# EAGLE schematic 130805_AriloRX_0_0 (EAGLE 6.1)
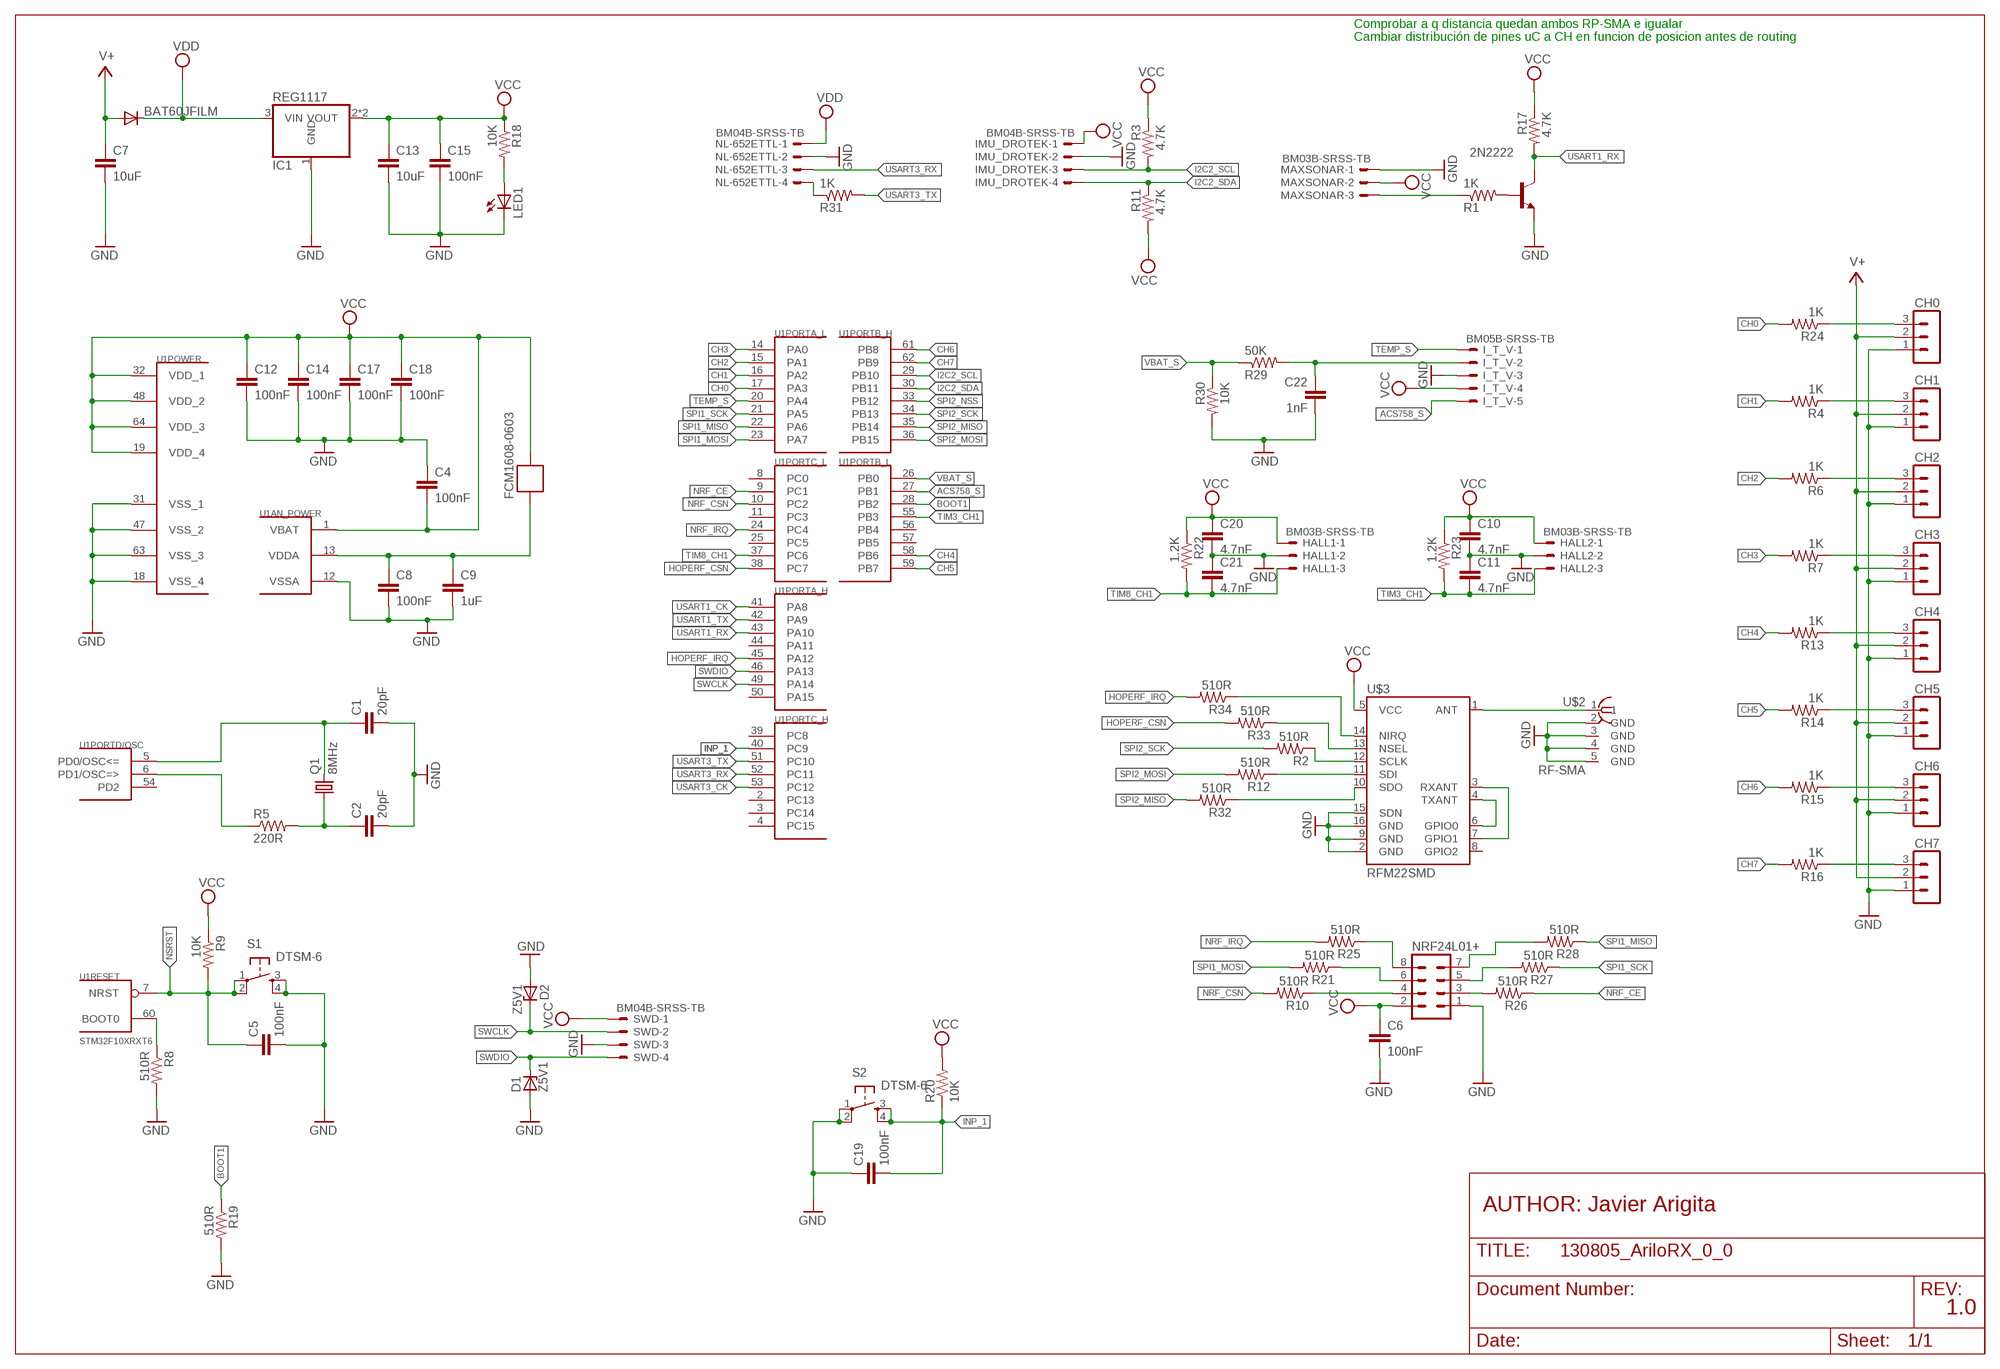
[diagram p0: schematic, sheet 1]

## Parts
2N2222  MMBT2222ALT1-NPN-SOT23-BEC  [SOT23-BEC]
BAT60JFILM  DIODE-SOD323-R  [SOD323-R]
C1  20pF  C-EUC0805  [C0805]
C2  20pF  C-EUC0805  [C0805]
C4  100nF  C-EUC0805  [C0805]
C5  100nF  C-EUC0805  [C0805]
C6  100nF  C-EUC0805  [C0805]
C7  10uF  C-EUC3216  [C3216]
C8  100nF  C-EUC0805  [C0805]
C9  1uF  C-EUC3216  [C3216]
C10  4.7nF  C-EUC0805  [C0805]
C11  4.7nF  C-EUC0805  [C0805]
C12  100nF  C-EUC0805  [C0805]
C13  10uF  C-EUC3216  [C3216]
C14  100nF  C-EUC0805  [C0805]
C15  100nF  C-EUC0805  [C0805]
C17  100nF  C-EUC0805  [C0805]
C18  100nF  C-EUC0805  [C0805]
C19  100nF  C-EUC0805  [C0805]
C20  4.7nF  C-EUC0805  [C0805]
C21  4.7nF  C-EUC0805  [C0805]
C22  1nF  C-EUC0805  [C0805]
CH0  MA03-1  [MA03-1]
CH1  MA03-1  [MA03-1]
CH2  MA03-1  [MA03-1]
CH3  MA03-1  [MA03-1]
CH4  MA03-1  [MA03-1]
CH5  MA03-1  [MA03-1]
CH6  MA03-1  [MA03-1]
CH7  MA03-1  [MA03-1]
D1  Z5V1  ZENER-DIODESOD80C  [SOD80C]
D2  Z5V1  ZENER-DIODESOD80C  [SOD80C]
FCM1608-0603  FERRITE-BEAD  [R0603]
HALL1  BM03B-SRSS-TB  [BM03B-SRSS-TB]
HALL2  BM03B-SRSS-TB  [BM03B-SRSS-TB]
I_T_V  BM05B-SRSS-TB  [BM05B-SRSS-TB]
IC1  REG1117  [SOT223]
IMU_DROTEK  BM04B-SRSS-TB  [BM04B-SRSS-TB]
LED1  LED0805  [CHIPLED_0805]
MAXSONAR  BM03B-SRSS-TB  [BM03B-SRSS-TB]
NL-652ETTL  BM04B-SRSS-TB  [BM04B-SRSS-TB]
NRF24L01+  MA04-2  [MA04-2]
Q1  8MHz  CRYSTALSM49  [SM49]
R1  1K  RESISTOR0805  [R0805]
R2  510R  RESISTOR0805  [R0805]
R3  4.7K  RESISTOR0805  [R0805]
R4  1K  RESISTOR0805  [R0805]
R5  220R  RESISTOR0805  [R0805]
R6  1K  RESISTOR0805  [R0805]
R7  1K  RESISTOR0805  [R0805]
R8  510R  RESISTOR0805  [R0805]
R9  10K  RESISTOR0805  [R0805]
R10  510R  RESISTOR0805  [R0805]
R11  4.7K  RESISTOR0805  [R0805]
R12  510R  RESISTOR0805  [R0805]
R13  1K  RESISTOR0805  [R0805]
R14  1K  RESISTOR0805  [R0805]
R15  1K  RESISTOR0805  [R0805]
R16  1K  RESISTOR0805  [R0805]
R17  4.7K  RESISTOR0805  [R0805]
R18  10K  RESISTOR0805  [R0805]
R19  510R  RESISTOR0805  [R0805]
R20  10K  RESISTOR0805  [R0805]
R21  510R  RESISTOR0805  [R0805]
R22  1.2K  RESISTOR0805  [R0805]
R23  1.2K  RESISTOR0805  [R0805]
R24  1K  RESISTOR0805  [R0805]
R25  510R  RESISTOR0805  [R0805]
R26  510R  RESISTOR0805  [R0805]
R27  510R  RESISTOR0805  [R0805]
R28  510R  RESISTOR0805  [R0805]
R29  50K  RESISTOR0805  [R0805]
R30  10K  RESISTOR0805  [R0805]
R31  1K  RESISTOR0805  [R0805]
R32  510R  RESISTOR0805  [R0805]
R33  510R  RESISTOR0805  [R0805]
R34  510R  RESISTOR0805  [R0805]
S1  DTSM-6  [DTSM-6]
S2  DTSM-6  [DTSM-6]
SWD  BM04B-SRSS-TB  [BM04B-SRSS-TB]
U1  STM32F10XRXT6  [TQFP64]
U$2  RF-SMA  [BU-SMA-H]
U$3  RFM22SMD  [RFM22-XXX-S2]

## Nets
ACS758_S: I_T_V.5 U1.27(PORTB_L:PB1)
BOOT1: R19.1 U1.28(PORTB_L:PB2)
CH0: R24.2 U1.17(PORTA_L:PA3)
CH1: R4.2 U1.16(PORTA_L:PA2)
CH2: R6.2 U1.15(PORTA_L:PA1)
CH3: R7.2 U1.14(PORTA_L:PA0)
CH4: R13.2 U1.58(PORTB_L:PB6)
CH5: R14.2 U1.59(PORTB_L:PB7)
CH6: R15.2 U1.61(PORTB_H:PB8)
CH7: R16.2 U1.62(PORTB_H:PB9)
GND: 2N2222.E C1.2 C2.2 C4.1 C5.2 C6.2 C7.2 C8.2 C9.2 C10.2 C11.1 C12.2 C13.2 C14.2 C15.2 C17.2 C18.2 C19.1 C20.2 C21.1 C22.2 CH0.1 CH1.1 CH2.1 CH3.1 CH4.1 CH5.1 CH6.1 CH7.1 D1.A D2.A HALL1.2 HALL2.2 I_T_V.3 IC1.1(GND) IMU_DROTEK.2 LED1.C MAXSONAR.1 NL-652ETTL.2 NRF24L01+.1 R8.2 R19.2 R30.2 S1.3 S1.4 S2.1 S2.2 SWD.3 U1.12(AN_POWER:VSSA) U1.18(POWER:VSS_4) U1.31(POWER:VSS_1) U1.47(POWER:VSS_2) U1.63(POWER:VSS_3) U$2.2(GND) U$2.3(GND) U$2.4(GND) U$2.5(GND) U$3.2(GND) U$3.9(GND) U$3.15(SDN) U$3.16(GND)
HOPERF_CSN: R33.2 U1.38(PORTC_L:PC7)
HOPERF_IRQ: R34.2 U1.45(PORTA_H:PA12)
I2C2_SCL: IMU_DROTEK.3 R3.2 U1.29(PORTB_H:PB10)
I2C2_SDA: IMU_DROTEK.4 R11.1 U1.30(PORTB_H:PB11)
INP_1: C19.2 R20.1 S2.3 S2.4 U1.40(PORTC_H:PC9)
N$1: C1.1 Q1.2 U1.5(PORTD/OSC:PD0/OSC<=)
N$2: R5.1 U1.6(PORTD/OSC:PD1/OSC=>)
N$3: C2.1 Q1.1 R5.2
N$4: R8.1 U1.60(RESET:BOOT0)
N$5: U$3.3(RXANT) U$3.7(GPIO1)
N$6: U$3.4(TXANT) U$3.6(GPIO0)
N$7: R2.1 U$3.12(SCLK)
N$8: R12.1 U$3.11(SDI)
N$9: CH0.3 R24.1
N$10: LED1.A R18.2
N$11: NL-652ETTL.4 R31.1
N$12: R32.1 U$3.10(SDO)
N$14: MAXSONAR.3 R1.1
N$15: C22.1 I_T_V.2 R29.2
N$16: 2N2222.B R1.2
N$17: C8.1 C9.1 FCM1608-0603.2 U1.13(AN_POWER:VDDA)
N$18: NRF24L01+.4 R10.1
N$19: NRF24L01+.3 R26.2
N$20: U$2.1 U$3.1(ANT)
N$21: CH2.3 R6.1
N$22: R34.1 U$3.14(NIRQ)
N$23: CH4.3 R13.1
N$24: R33.1 U$3.13(NSEL)
N$31: CH3.3 R7.1
N$32: CH6.3 R15.1
N$34: CH5.3 R14.1
N$35: CH7.3 R16.1
N$36: NRF24L01+.5 R27.2
N$38: NRF24L01+.6 R21.1
N$39: NRF24L01+.8 R25.1
N$42: NRF24L01+.7 R28.2
N$53: CH1.3 R4.1
NRF_CE: R26.1 U1.9(PORTC_L:PC1)
NRF_CSN: R10.2 U1.10(PORTC_L:PC2)
NRF_IRQ: R25.2 U1.24(PORTC_L:PC4)
NSRST: C5.1 R9.2 S1.1 S1.2 U1.7(RESET:NRST)
SPI1_MISO: R28.1 U1.22(PORTA_L:PA6)
SPI1_MOSI: R21.2 U1.23(PORTA_L:PA7)
SPI1_SCK: R27.1 U1.21(PORTA_L:PA5)
SPI2_MISO: R32.2 U1.35(PORTB_H:PB14)
SPI2_MOSI: R12.2 U1.36(PORTB_H:PB15)
SPI2_NSS: U1.33(PORTB_H:PB12)
SPI2_SCK: R2.2 U1.34(PORTB_H:PB13)
SWCLK: D2.C SWD.2 U1.49(PORTA_H:PA14)
SWDIO: D1.C SWD.4 U1.46(PORTA_H:PA13)
TEMP_S: I_T_V.1 U1.20(PORTA_L:PA4)
TIM3_CH1: C11.2 HALL2.3 R23.2 U1.55(PORTB_L:PB3)
TIM8_CH1: C21.2 HALL1.3 R22.2 U1.37(PORTC_L:PC6)
USART1_CK: U1.41(PORTA_H:PA8)
USART1_RX: 2N2222.C R17.2 U1.43(PORTA_H:PA10)
USART1_TX: U1.42(PORTA_H:PA9)
USART3_CK: U1.53(PORTC_H:PC12)
USART3_RX: NL-652ETTL.3 U1.52(PORTC_H:PC11)
USART3_TX: R31.2 U1.51(PORTC_H:PC10)
V+: BAT60JFILM.A C7.1 CH0.2 CH1.2 CH2.2 CH3.2 CH4.2 CH5.2 CH6.2 CH7.2
VBAT_S: R29.1 R30.1 U1.26(PORTB_L:PB0)
VCC: C4.2 C6.1 C10.1 C12.1 C13.1 C14.1 C15.1 C17.1 C18.1 C20.1 FCM1608-0603.1 HALL1.1 HALL2.1 I_T_V.4 IC1.2(VOUT) IC1.4(VOUT) IMU_DROTEK.1 MAXSONAR.2 NRF24L01+.2 R3.1 R9.1 R11.2 R17.1 R18.1 R20.2 R22.1 R23.1 SWD.1 U1.1(AN_POWER:VBAT) U1.19(POWER:VDD_4) U1.32(POWER:VDD_1) U1.48(POWER:VDD_2) U1.64(POWER:VDD_3) U$3.5(VCC)
VDD: BAT60JFILM.C IC1.3(VIN) NL-652ETTL.1
Unconnected: U1.2(PORTC_H:PC13) U1.3(PORTC_H:PC14) U1.4(PORTC_H:PC15) U1.8(PORTC_L:PC0) U1.11(PORTC_L:PC3) U1.25(PORTC_L:PC5) U1.39(PORTC_H:PC8) U1.44(PORTA_H:PA11) U1.50(PORTA_H:PA15) U1.54(PORTD/OSC:PD2) U1.56(PORTB_L:PB4) U1.57(PORTB_L:PB5) U$3.8(GPIO2)

## Notes on the sheet
- Comprobar a q distancia quedan ambos RP-SMA e igualar
- Cambiar distribución de pines uC a CH en funcion de posicion antes de routing
- AUTHOR: Javier Arigita
- 1.0

## Library data of the parts
2N2222 = transistor:*-NPN-: NPN Transistror BF959 corrected 2008.03.06
BAT60JFILM = diode:DIODE-: DIODE
C1 C2 C4-C6 C8 C10-C12 C14 C15 C17-C22 = rcl:C-EU: CAPACITOR, European symbol
C7 C9 C13 = resistor:C-EU: CAPACITOR, European symbol
CH0 CH1-CH7 = con-lstb:MA03-1: PIN HEADER; OC_FARNELL: unknown; OC_NEWARK: unknown
D1 D2 = diode:ZENER-DIODE: Z-Diode
FCM1608-0603 = BaseApp:FERRITE-BEAD
HALL1 HALL2 MAXSONAR = con-jst2:?M03B-SRSS-TB: Disconnectable Crimp style connector, 1.0mm pitch 3 contacts
I_T_V = con-jst2:?M05B-SRSS-TB: Disconnectable Crimp style connector, 1.0mm pitch 5 contacts
IC1 = CEDT:REG1117: 800mA and 1A Low Dropout (LDO) Positive Regulator 1.8V, 2.5V, 2.85V, 3.3V, 5V, and Adj
IMU_DROTEK NL-652ETTL SWD = con-jst2:?M04B-SRSS-TB: Disconnectable Crimp style connector, 1.0mm pitch 4 contacts
LED1 = CEDT:LED
NRF24L01+ = con-lstb:MA04-2: PIN HEADER; OC_FARNELL: unknown; OC_NEWARK: unknown
Q1 = crystal:CRYSTAL: CRYSTAL; OC_FARNELL: unknown; OC_NEWARK: unknown
R1-R34 = CEDT:RESISTOR
S1 S2 = switch-tact:DTSM-6
U1 = stm32:STM32F10XRXT6: STM32F101/103 64pin LQFP
U$2 = BaseApp:RF-SMA
U$3 = SparkFun-RF:RFM22: The RFM22 is a low-power, low cost radio that is capable of operating in the 434MHz and 900MHz open bands. It's frequency is software defined and there are some very good libraries written for it.